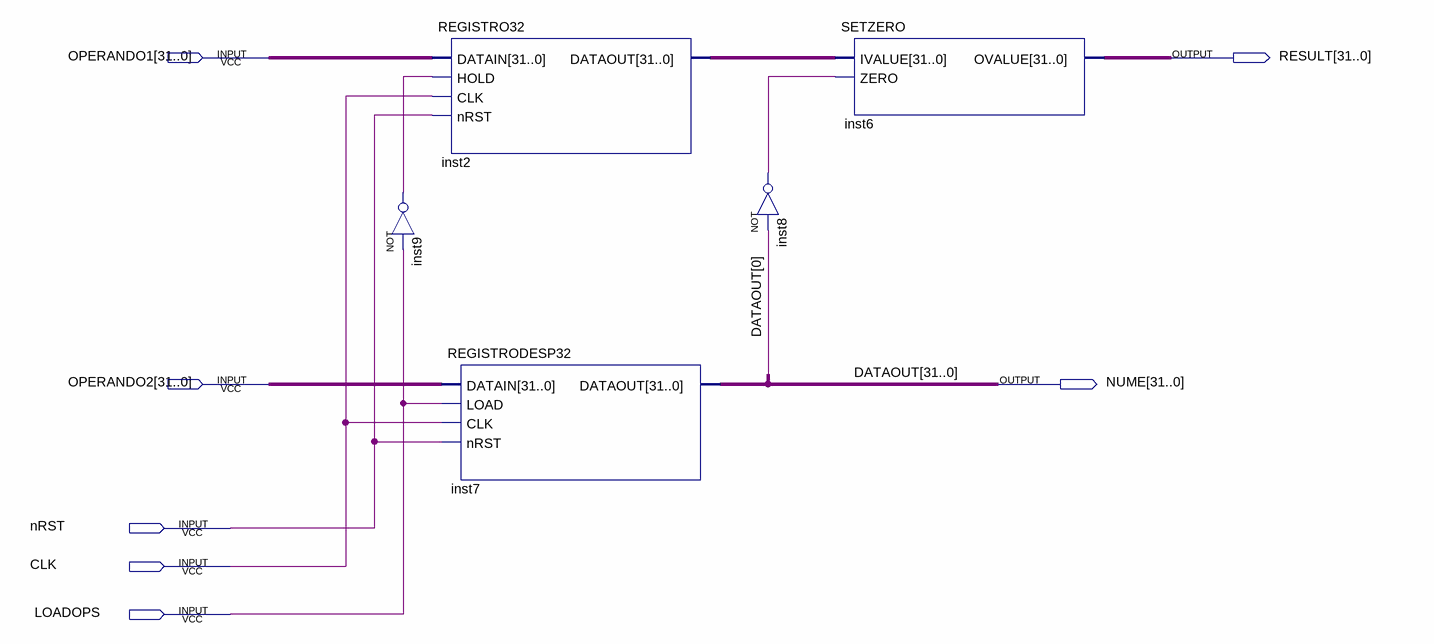
[diagram p0: schematic sheet]
// Quartus schematic TEST3.bdf as structural Verilog: 5 symbols, 7 pins
module TEST3 (
  input  [31:0] OPERANDO1,
  input  [31:0] OPERANDO2,
  input  nRST,
  input  CLK,
  input  LOADOPS,
  output [31:0] RESULT,
  output [31:0] NUME
);

  wire inst8_out, inst9_out;
  wire [31:0] inst2_dataout;

  not inst9 (inst9_out, LOADOPS);
  REGISTRO32 inst2 (.DATAIN(OPERANDO1), .HOLD(inst9_out), .CLK(CLK), .nRST(nRST), .DATAOUT(inst2_dataout));
  REGISTRODESP32 inst7 (.DATAIN(OPERANDO2), .LOAD(LOADOPS), .CLK(CLK), .nRST(nRST), .DATAOUT(NUME));
  not inst8 (inst8_out, NUME[0]);
  SETZERO inst6 (.IVALUE(inst2_dataout), .ZERO(inst8_out), .OVALUE(RESULT));

  // Other names for the same wires on the sheet: DATAOUT[31:0] = NUME
endmodule
